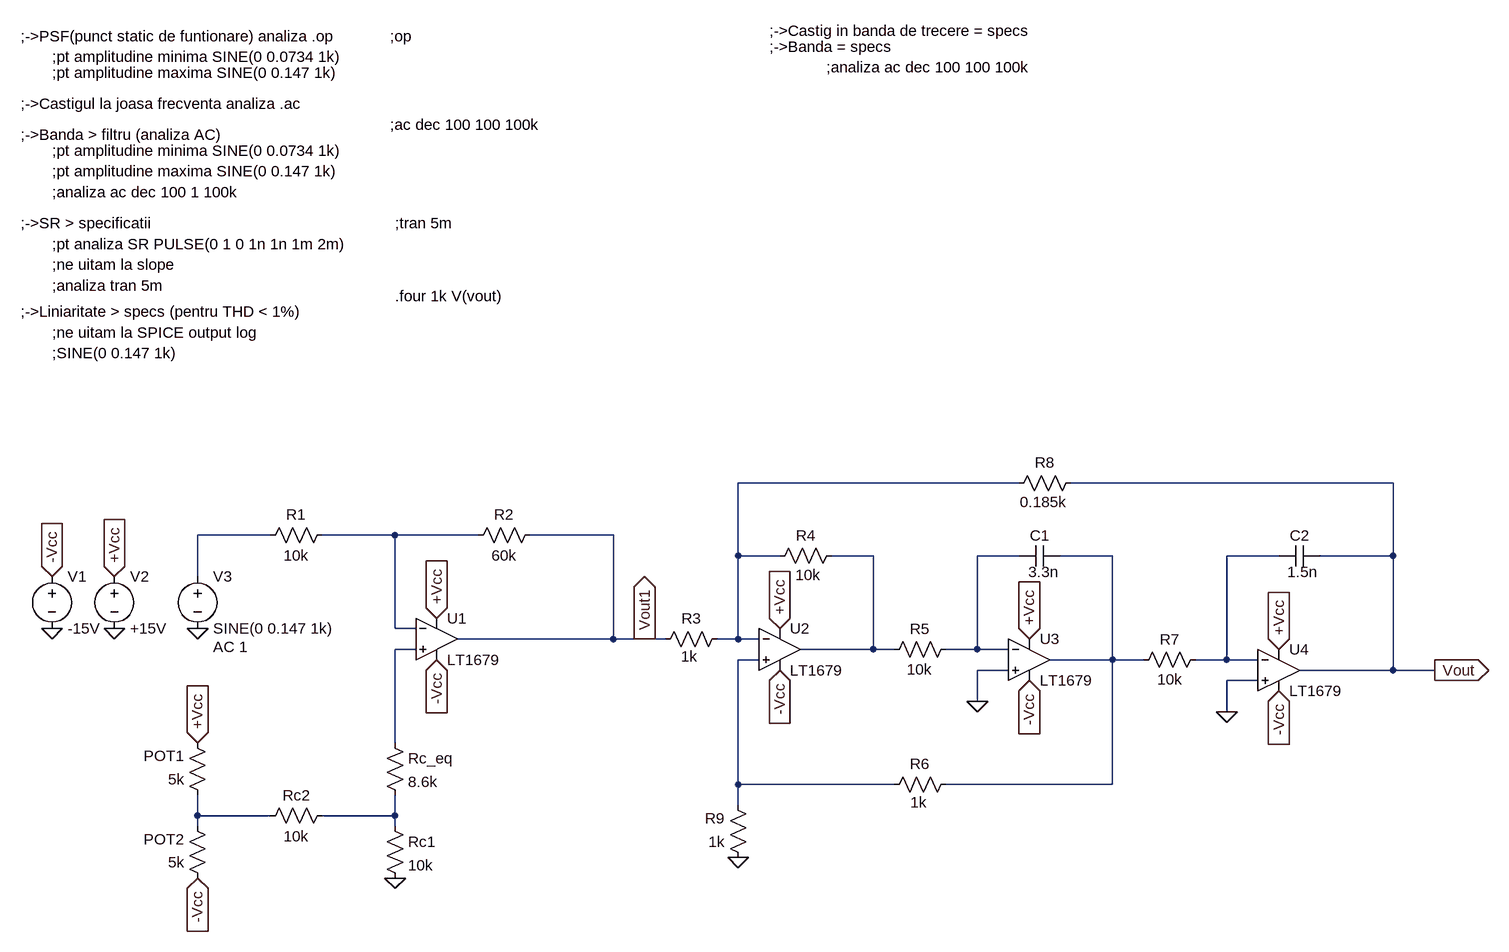
[diagram p0: schematic ProiectSCIA_Etaj2_Finalizat.asc]
ProiectSCIA_Etaj2_Finalizat.asc, the LTspice schematic file:
Version 4.1
SHEET 1 2416 680
WIRE 1360 -176 928 -176
WIRE 1936 -176 1440 -176
WIRE 208 -96 96 -96
WIRE 400 -96 288 -96
WIRE 528 -96 400 -96
WIRE 736 -96 608 -96
WIRE 928 -64 928 -176
WIRE 992 -64 928 -64
WIRE 1136 -64 1072 -64
WIRE 1360 -64 1296 -64
WIRE 1504 -64 1424 -64
WIRE 1760 -64 1680 -64
WIRE 1936 -64 1936 -176
WIRE 1936 -64 1824 -64
WIRE 96 -32 96 -96
WIRE 400 48 400 -96
WIRE 432 48 400 48
WIRE 736 64 736 -96
WIRE 736 64 496 64
WIRE 784 64 736 64
WIRE 816 64 784 64
WIRE 928 64 928 -64
WIRE 928 64 896 64
WIRE 960 64 928 64
WIRE 432 80 400 80
WIRE 1136 80 1136 -64
WIRE 1136 80 1024 80
WIRE 1168 80 1136 80
WIRE 1296 80 1296 -64
WIRE 1296 80 1248 80
WIRE 1344 80 1296 80
WIRE 960 96 928 96
WIRE 1504 96 1504 -64
WIRE 1504 96 1408 96
WIRE 1552 96 1504 96
WIRE 1680 96 1680 -64
WIRE 1680 96 1632 96
WIRE 1728 96 1680 96
WIRE 1344 112 1296 112
WIRE 1936 112 1936 -64
WIRE 1936 112 1792 112
WIRE 2000 112 1936 112
WIRE 1728 128 1680 128
WIRE 1296 160 1296 112
WIRE 1680 176 1680 128
WIRE 400 224 400 80
WIRE 928 288 928 96
WIRE 1168 288 928 288
WIRE 1504 288 1504 96
WIRE 1504 288 1248 288
WIRE 928 320 928 288
WIRE 96 336 96 304
WIRE 208 336 96 336
WIRE 400 336 400 304
WIRE 400 336 288 336
WIRE 96 352 96 336
WIRE 400 352 400 336
FLAG 464 32 +Vcc
IOPIN 464 32 In
FLAG -32 -32 +Vcc
IOPIN -32 -32 In
FLAG -128 -32 -Vcc
IOPIN -128 -32 In
FLAG 464 96 -Vcc
IOPIN 464 96 In
FLAG -128 48 0
FLAG -32 48 0
FLAG 96 48 0
FLAG 400 432 0
FLAG 96 224 +Vcc
IOPIN 96 224 In
FLAG 96 432 -Vcc
IOPIN 96 432 In
FLAG 2000 112 Vout
IOPIN 2000 112 Out
FLAG 992 48 +Vcc
IOPIN 992 48 In
FLAG 992 112 -Vcc
IOPIN 992 112 In
FLAG 1376 64 +Vcc
IOPIN 1376 64 In
FLAG 1376 128 -Vcc
IOPIN 1376 128 In
FLAG 1296 160 0
FLAG 1760 80 +Vcc
IOPIN 1760 80 In
FLAG 1760 144 -Vcc
IOPIN 1760 144 In
FLAG 1680 176 0
FLAG 784 64 Vout1
IOPIN 784 64 Out
FLAG 928 400 0
SYMBOL voltage -128 -48 R0
WINDOW 123 0 0 Left 0
WINDOW 39 0 0 Left 0
SYMATTR InstName V1
SYMATTR Value -15V
SYMBOL voltage -32 -48 R0
WINDOW 123 0 0 Left 0
WINDOW 39 0 0 Left 0
SYMATTR InstName V2
SYMATTR Value +15V
SYMBOL voltage 96 -48 R0
WINDOW 123 24 124 Left 2
WINDOW 39 0 0 Left 0
SYMATTR Value2 AC 1
SYMATTR InstName V3
SYMATTR Value SINE(0 0.147 1k)
SYMBOL res 304 -112 R90
WINDOW 0 0 56 VBottom 2
WINDOW 3 32 56 VTop 2
SYMATTR InstName R1
SYMATTR Value 10k
SYMBOL res 624 -112 R90
WINDOW 0 0 56 VBottom 2
WINDOW 3 32 56 VTop 2
SYMATTR InstName R2
SYMATTR Value 60k
SYMBOL OpAmps\\LT1679 464 64 R0
SYMATTR InstName U1
SYMBOL res 384 208 R0
SYMATTR InstName Rc_eq
SYMATTR Value 8.6k
SYMBOL res 304 320 R90
WINDOW 0 0 56 VBottom 2
WINDOW 3 32 56 VTop 2
SYMATTR InstName Rc2
SYMATTR Value 10k
SYMBOL res 112 320 R180
WINDOW 0 36 76 Left 2
WINDOW 3 36 40 Left 2
SYMATTR InstName POT1
SYMATTR Value 5k
SYMBOL res 112 448 R180
WINDOW 0 36 76 Left 2
WINDOW 3 36 40 Left 2
SYMATTR InstName POT2
SYMATTR Value 5k
SYMBOL res 384 336 R0
SYMATTR InstName Rc1
SYMATTR Value 10k
SYMBOL OpAmps\\LT1679 992 80 R0
SYMATTR InstName U2
SYMBOL res 912 48 R90
WINDOW 0 0 56 VBottom 2
WINDOW 3 58 59 VBottom 2
SYMATTR InstName R3
SYMATTR Value 1k
SYMBOL res 1088 -80 R90
WINDOW 0 0 56 VBottom 2
WINDOW 3 61 52 VBottom 2
SYMATTR InstName R4
SYMATTR Value 10k
SYMBOL res 1264 64 R90
WINDOW 0 0 56 VBottom 2
WINDOW 3 62 57 VBottom 2
SYMATTR InstName R5
SYMATTR Value 10k
SYMBOL OpAmps\\LT1679 1376 96 R0
SYMATTR InstName U3
SYMBOL cap 1424 -80 R90
WINDOW 0 0 32 VBottom 2
WINDOW 3 56 26 VBottom 2
SYMATTR InstName C1
SYMATTR Value 3.3n
SYMBOL res 1264 272 R90
WINDOW 0 0 56 VBottom 2
WINDOW 3 59 58 VBottom 2
SYMATTR InstName R6
SYMATTR Value 1k
SYMBOL res 1648 80 R90
WINDOW 0 0 56 VBottom 2
WINDOW 3 62 55 VBottom 2
SYMATTR InstName R7
SYMATTR Value 10k
SYMBOL OpAmps\\LT1679 1760 112 R0
SYMATTR InstName U4
SYMBOL cap 1824 -80 R90
WINDOW 0 0 32 VBottom 2
WINDOW 3 56 27 VBottom 2
SYMATTR InstName C2
SYMATTR Value 1.5n
SYMBOL res 1456 -192 R90
WINDOW 0 0 56 VBottom 2
WINDOW 3 61 58 VBottom 2
SYMATTR InstName R8
SYMATTR Value 0.185k
SYMBOL res 944 416 R180
WINDOW 0 36 76 Left 2
WINDOW 3 36 40 Left 2
SYMATTR InstName R9
SYMATTR Value 1k
TEXT -176 -864 Left 2 !;->PSF(punct static de funtionare) analiza .op
TEXT -176 -760 Left 2 !;->Castigul la joasa frecventa analiza .ac
TEXT -128 -832 Left 2 !;pt amplitudine minima SINE(0 0.0734 1k)
TEXT -128 -808 Left 2 !;pt amplitudine maxima SINE(0 0.147 1k)
TEXT -176 -712 Left 2 !;->Banda > filtru (analiza AC)
TEXT -128 -688 Left 2 !;pt amplitudine minima SINE(0 0.0734 1k)
TEXT -128 -656 Left 2 !;pt amplitudine maxima SINE(0 0.147 1k)
TEXT -176 -576 Left 2 !;->SR > specificatii
TEXT -128 -544 Left 2 !;pt analiza SR PULSE(0 1 0 1n 1n 1m 2m)
TEXT -128 -512 Left 2 !;ne uitam la slope
TEXT -176 -440 Left 2 !;->Liniaritate > specs (pentru THD < 1%)
TEXT 400 -464 Left 2 !.four 1k V(vout)
TEXT -128 -408 Left 2 !;ne uitam la SPICE output log
TEXT -128 -376 Left 2 !;SINE(0 0.147 1k)
TEXT -128 -624 Left 2 !;analiza ac dec 100 1 100k
TEXT -128 -480 Left 2 !;analiza tran 5m
TEXT 392 -728 Left 2 !;ac dec 100 100 100k
TEXT 976 -872 Left 2 !;->Castig in banda de trecere = specs
TEXT 976 -848 Left 2 !;->Banda = specs
TEXT 1064 -816 Left 2 !;analiza ac dec 100 100 100k
TEXT 392 -864 Left 2 !;op
TEXT 400 -576 Left 2 !;tran 5m

The netlist it stands for:
* ProiectSCIA_Etaj2_Finalizat.asc
V1 -Vcc 0 -15V
V2 +Vcc 0 +15V
V3 N002 0 SINE(0 0.147 1k) AC 1
R1 N003 N002 10k
R2 Vout1 N003 60k
* U1: LT1679 (symbol OpAmps\LT1679 not available, pins judged from their places): In+=N008 In-=N003 V+=+Vcc V-=-Vcc OUT=Vout1
Rc_eq N008 N011 8.6k
Rc2 N011 N010 10k
R§POT1 N010 +Vcc 5k
R§POT2 -Vcc N010 5k
Rc1 N011 0 10k
* U2: LT1679 (symbol OpAmps\LT1679 not available, pins judged from their places): In+=N009 In-=N001 V+=+Vcc V-=-Vcc OUT=N004
R3 N001 Vout1 1k
R4 N004 N001 10k
R5 N005 N004 10k
* U3: LT1679 (symbol OpAmps\LT1679 not available, pins judged from their places): In+=0 In-=N005 V+=+Vcc V-=-Vcc OUT=N006
C1 N006 N005 3.3n
R6 N006 N009 1k
R7 N007 N006 10k
* U4: LT1679 (symbol OpAmps\LT1679 not available, pins judged from their places): In+=0 In-=N007 V+=+Vcc V-=-Vcc OUT=Vout
C2 Vout N007 1.5n
R8 Vout N001 0.185k
R9 0 N009 1k
;->PSF(punct static de funtionare) analiza .op
;->Castigul la joasa frecventa analiza .ac
;pt amplitudine minima SINE(0 0.0734 1k)
;pt amplitudine maxima SINE(0 0.147 1k)
;->Banda > filtru (analiza AC)
;pt amplitudine minima SINE(0 0.0734 1k)
;pt amplitudine maxima SINE(0 0.147 1k)
;->SR > specificatii
;pt analiza SR PULSE(0 1 0 1n 1n 1m 2m)
;ne uitam la slope
;->Liniaritate > specs (pentru THD < 1%)
.four 1k V(vout)
;ne uitam la SPICE output log
;SINE(0 0.147 1k)
;analiza ac dec 100 1 100k
;analiza tran 5m
;ac dec 100 100 100k
;->Castig in banda de trecere = specs
;->Banda = specs
;analiza ac dec 100 100 100k
;op
;tran 5m
.backanno
.end